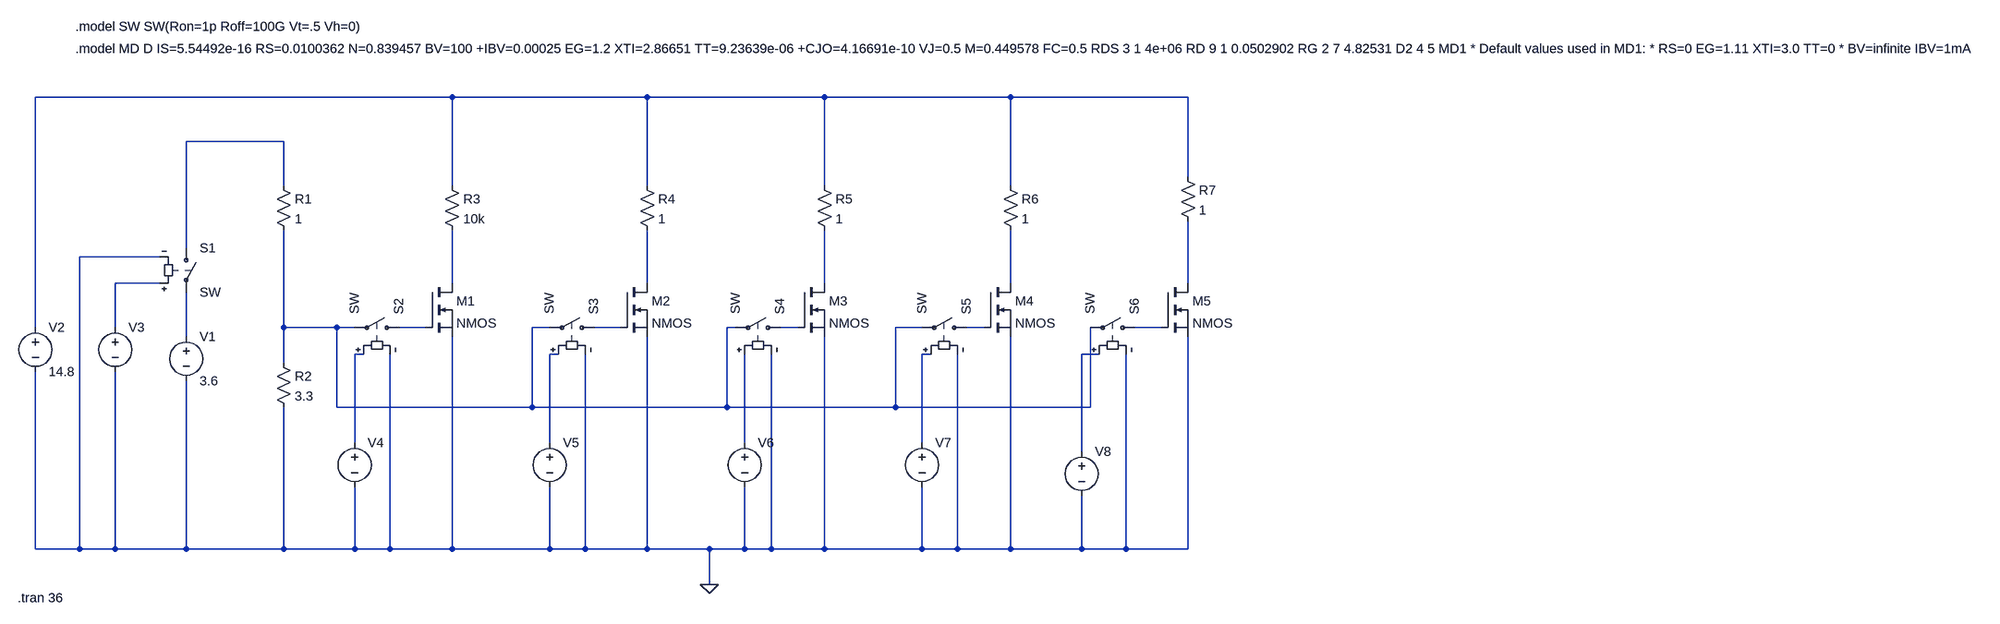
[diagram p0: schematic BreakBoard.asc]
BreakBoard.asc, the LTspice schematic file:
Version 4
SHEET 1 2792 680
WIRE -256 -528 -1008 -528
WIRE 96 -528 -256 -528
WIRE 416 -528 96 -528
WIRE 752 -528 416 -528
WIRE 1072 -528 752 -528
WIRE -560 -448 -736 -448
WIRE 1072 -384 1072 -528
WIRE -560 -368 -560 -448
WIRE -256 -368 -256 -528
WIRE 96 -368 96 -528
WIRE 416 -368 416 -528
WIRE 752 -368 752 -528
WIRE -736 -256 -736 -448
WIRE -784 -240 -928 -240
WIRE -784 -192 -864 -192
WIRE -256 -192 -256 -288
WIRE 96 -192 96 -288
WIRE 416 -192 416 -288
WIRE 752 -192 752 -288
WIRE 1072 -192 1072 -304
WIRE -1008 -112 -1008 -528
WIRE -864 -112 -864 -192
WIRE -560 -112 -560 -288
WIRE -464 -112 -560 -112
WIRE -432 -112 -464 -112
WIRE -304 -112 -352 -112
WIRE -80 -112 -112 -112
WIRE 48 -112 0 -112
WIRE 256 -112 240 -112
WIRE 368 -112 336 -112
WIRE 592 -112 544 -112
WIRE 704 -112 672 -112
WIRE 1024 -112 976 -112
WIRE -736 -96 -736 -176
WIRE -416 -64 -432 -64
WIRE -64 -64 -80 -64
WIRE 608 -64 592 -64
WIRE 912 -64 880 -64
WIRE -560 -48 -560 -112
WIRE -464 32 -464 -112
WIRE -112 32 -112 -112
WIRE -112 32 -464 32
WIRE 240 32 240 -112
WIRE 240 32 -112 32
WIRE 544 32 544 -112
WIRE 544 32 240 32
WIRE 896 32 896 -112
WIRE 896 32 544 32
WIRE -432 96 -432 -64
WIRE -80 96 -80 -64
WIRE 272 96 272 -64
WIRE 592 96 592 -64
WIRE 880 112 880 -64
WIRE -1008 288 -1008 -32
WIRE -928 288 -928 -240
WIRE -928 288 -1008 288
WIRE -864 288 -864 -32
WIRE -864 288 -928 288
WIRE -736 288 -736 -16
WIRE -736 288 -864 288
WIRE -560 288 -560 32
WIRE -560 288 -736 288
WIRE -432 288 -432 176
WIRE -432 288 -560 288
WIRE -368 288 -368 -64
WIRE -368 288 -432 288
WIRE -256 288 -256 -96
WIRE -256 288 -368 288
WIRE -80 288 -80 176
WIRE -80 288 -256 288
WIRE -16 288 -16 -64
WIRE -16 288 -80 288
WIRE 96 288 96 -96
WIRE 96 288 -16 288
WIRE 208 288 96 288
WIRE 272 288 272 176
WIRE 272 288 208 288
WIRE 320 288 320 -64
WIRE 320 288 272 288
WIRE 416 288 416 -96
WIRE 416 288 320 288
WIRE 592 288 592 176
WIRE 592 288 416 288
WIRE 656 288 656 -64
WIRE 656 288 592 288
WIRE 752 288 752 -96
WIRE 752 288 656 288
WIRE 880 288 880 192
WIRE 880 288 752 288
WIRE 960 288 960 -64
WIRE 960 288 880 288
WIRE 1072 288 1072 -96
WIRE 1072 288 960 288
WIRE 208 352 208 288
FLAG 208 352 0
SYMBOL voltage -736 -112 R0
WINDOW 123 0 0 Left 0
WINDOW 39 0 0 Left 0
SYMATTR InstName V1
SYMATTR Value 3.6
SYMBOL res -576 -384 R0
SYMATTR InstName R1
SYMATTR Value 1
SYMBOL res -576 -64 R0
SYMATTR InstName R2
SYMATTR Value 3.3
SYMBOL nmos 48 -192 R0
SYMATTR InstName M2
SYMBOL nmos 368 -192 R0
SYMATTR InstName M3
SYMBOL nmos 704 -192 R0
SYMATTR InstName M4
SYMBOL nmos 1024 -192 R0
SYMATTR InstName M5
SYMBOL nmos -304 -192 R0
SYMATTR InstName M1
SYMBOL voltage -1008 -128 R0
WINDOW 123 0 0 Left 0
WINDOW 39 0 0 Left 0
SYMATTR InstName V2
SYMATTR Value 14.8
SYMBOL sw -736 -272 R0
SYMATTR InstName S1
SYMBOL sw -336 -112 M270
SYMATTR InstName S2
SYMBOL sw 16 -112 M270
SYMATTR InstName S3
SYMBOL sw 352 -112 M270
SYMATTR InstName S4
SYMBOL sw 688 -112 M270
SYMATTR InstName S5
SYMBOL sw 992 -112 M270
SYMATTR InstName S6
SYMBOL voltage -864 -128 R0
WINDOW 3 24 96 Invisible 2
WINDOW 123 0 0 Left 0
WINDOW 39 0 0 Left 0
SYMATTR Value PULSE(0 5 10 1n 1n 5 10 1)
SYMATTR InstName V3
SYMBOL voltage -432 80 R0
WINDOW 3 24 96 Invisible 2
WINDOW 123 0 0 Left 0
WINDOW 39 0 0 Left 0
SYMATTR Value PULSE(0 5 0 1n 1n 4 20 1)
SYMATTR InstName V4
SYMBOL voltage -80 80 R0
WINDOW 3 24 96 Invisible 2
WINDOW 123 0 0 Left 0
WINDOW 39 0 0 Left 0
SYMATTR Value PULSE(0 5 0 1n 1n 30 10 1)
SYMATTR InstName V5
SYMBOL voltage 272 80 R0
WINDOW 3 24 96 Invisible 2
WINDOW 123 0 0 Left 0
WINDOW 39 0 0 Left 0
SYMATTR Value PULSE(0 5 12 1n 1n 30 20 1)
SYMATTR InstName V6
SYMBOL voltage 592 80 R0
WINDOW 3 24 96 Invisible 2
WINDOW 123 0 0 Left 0
WINDOW 39 0 0 Left 0
SYMATTR Value PULSE(0 5 18 1n 1n 30 10 1)
SYMATTR InstName V7
SYMBOL voltage 880 96 R0
WINDOW 3 24 96 Invisible 2
WINDOW 123 0 0 Left 0
WINDOW 39 0 0 Left 0
SYMATTR Value PULSE(0 5 24 1n 1n 30 10 1)
SYMATTR InstName V8
SYMBOL res -272 -384 R0
SYMATTR InstName R3
SYMATTR Value 10k
SYMBOL res 80 -384 R0
SYMATTR InstName R4
SYMATTR Value 1
SYMBOL res 400 -384 R0
SYMATTR InstName R5
SYMATTR Value 1
SYMBOL res 736 -384 R0
SYMATTR InstName R6
SYMATTR Value 1
SYMBOL res 1056 -400 R0
SYMATTR InstName R7
SYMATTR Value 1
TEXT -936 -616 Left 2 !.model MD D IS=5.54492e-16 RS=0.0100362 N=0.839457 BV=100 +IBV=0.00025 EG=1.2 XTI=2.86651 TT=9.23639e-06 +CJO=4.16691e-10 VJ=0.5 M=0.449578 FC=0.5 RDS 3 1 4e+06 RD 9 1 0.0502902 RG 2 7 4.82531 D2 4 5 MD1 * Default values used in MD1: * RS=0 EG=1.11 XTI=3.0 TT=0 * BV=infinite IBV=1mA
TEXT -936 -656 Left 2 !.model SW SW(Ron=1p Roff=100G Vt=.5 Vh=0)
TEXT -1040 376 Left 2 !.tran 36

The netlist it stands for:
* BreakBoard.asc
V1 N015 0 3.6
R1 N002 N009 1
R2 N009 0 3.3
M2 N005 N011 0 0 NMOS
M3 N006 N012 0 0 NMOS
M4 N007 N013 0 0 NMOS
M5 N008 N014 0 0 NMOS
M1 N004 N010 0 0 NMOS
V2 N001 0 14.8
S1 N002 N015 N003 0 SW
S2 N010 N009 N016 0 SW
S3 N011 N009 N017 0 SW
S4 N012 N009 N020 0 SW
S5 N013 N009 N018 0 SW
S6 N014 N009 N019 0 SW
V3 N003 0 PULSE(0 5 10 1n 1n 5 10 1)
V4 N016 0 PULSE(0 5 0 1n 1n 4 20 1)
V5 N017 0 PULSE(0 5 0 1n 1n 30 10 1)
V6 N020 0 PULSE(0 5 12 1n 1n 30 20 1)
V7 N018 0 PULSE(0 5 18 1n 1n 30 10 1)
V8 N019 0 PULSE(0 5 24 1n 1n 30 10 1)
R3 N001 N004 10k
R4 N001 N005 1
R5 N001 N006 1
R6 N001 N007 1
R7 N001 N008 1
.model NMOS NMOS
.model PMOS PMOS
.lib standard.mos
.model MD D IS=5.54492e-16 RS=0.0100362 N=0.839457 BV=100 +IBV=0.00025 EG=1.2 XTI=2.86651 TT=9.23639e-06 +CJO=4.16691e-10 VJ=0.5 M=0.449578 FC=0.5 RDS 3 1 4e+06 RD 9 1 0.0502902 RG 2 7 4.82531 D2 4 5 MD1 * Default values used in MD1: * RS=0 EG=1.11 XTI=3.0 TT=0 * BV=infinite IBV=1mA
.model SW SW(Ron=1p Roff=100G Vt=.5 Vh=0)
.tran 36
.backanno
.end